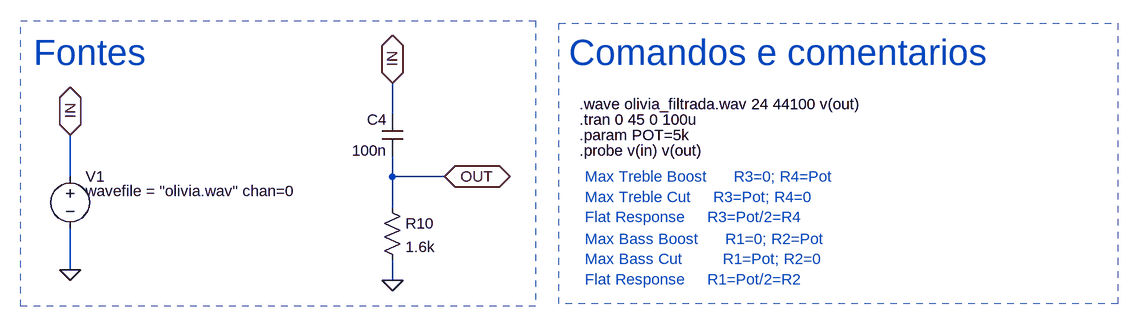
[diagram p0: schematic 5_wav.asc]
5_wav.asc, the LTspice schematic file:
Version 4
SHEET 1 2352 1568
WIRE 224 -48 224 -96
WIRE -272 48 -272 -16
WIRE 224 48 224 16
WIRE 304 48 224 48
WIRE 224 96 224 48
WIRE -272 192 -272 128
WIRE 224 208 224 176
FLAG -272 192 0
FLAG -272 -16 IN
IOPIN -272 -16 BiDir
FLAG 224 -96 IN
IOPIN 224 -96 BiDir
FLAG 224 208 0
FLAG 304 48 OUT
IOPIN 304 48 BiDir
SYMBOL voltage -272 32 R0
WINDOW 3 24 38 Left 2
SYMATTR Value wavefile = "olivia.wav" chan=0
SYMATTR InstName V1
SYMATTR Value2 AC 1
SYMBOL cap 240 16 R180
WINDOW 0 24 56 Left 2
WINDOW 3 24 8 Left 2
SYMATTR InstName C4
SYMATTR Value 100n
SYMBOL res 208 80 R0
SYMATTR InstName R10
SYMATTR Value 1.6k
TEXT -328 -144 Left 5 ;Fontes
TEXT 496 -144 Left 5 ;Comandos e comentarios
TEXT 512 -40 Left 2 !.tran 0 45 0 100u
TEXT 520 144 Left 2 ;Max Bass Boost  	R1=0; R2=Pot\nMax Bass Cut 		R1=Pot; R2=0\nFlat Response 	R1=Pot/2=R2
TEXT 520 48 Left 2 ;Max Treble Boost  	R3=0; R4=Pot\nMax Treble Cut 	R3=Pot; R4=0\nFlat Response 	R3=Pot/2=R4
TEXT 512 -64 Left 2 !.wave olivia_filtrada.wav 24 44100 v(out)
TEXT 512 -16 Left 2 !.param POT=5k
TEXT 512 8 Left 2 !.probe v(in) v(out)
RECTANGLE Normal 444 248 -348 -192 2
RECTANGLE Normal 480 -188 1340 244 2

The netlist it stands for:
* 5_wav.asc
V1 IN 0 wavefile = "olivia.wav" chan=0 AC 1
C4 OUT IN 100n
R10 OUT 0 1.6k
* Fontes
* Comandos e comentarios
.tran 0 45 0 100u
* Max Bass Boost  	R1=0; R2=Pot
* Max Bass Cut 		R1=Pot; R2=0
* Flat Response 	R1=Pot/2=R2
* Max Treble Boost  	R3=0; R4=Pot
* Max Treble Cut 	R3=Pot; R4=0
* Flat Response 	R3=Pot/2=R4
.wave olivia_filtrada.wav 24 44100 v(out)
.param POT=5k
.probe v(in) v(out)
.backanno
.end